# Altium schematic sheet Power_Sheet.SchDoc
size A3
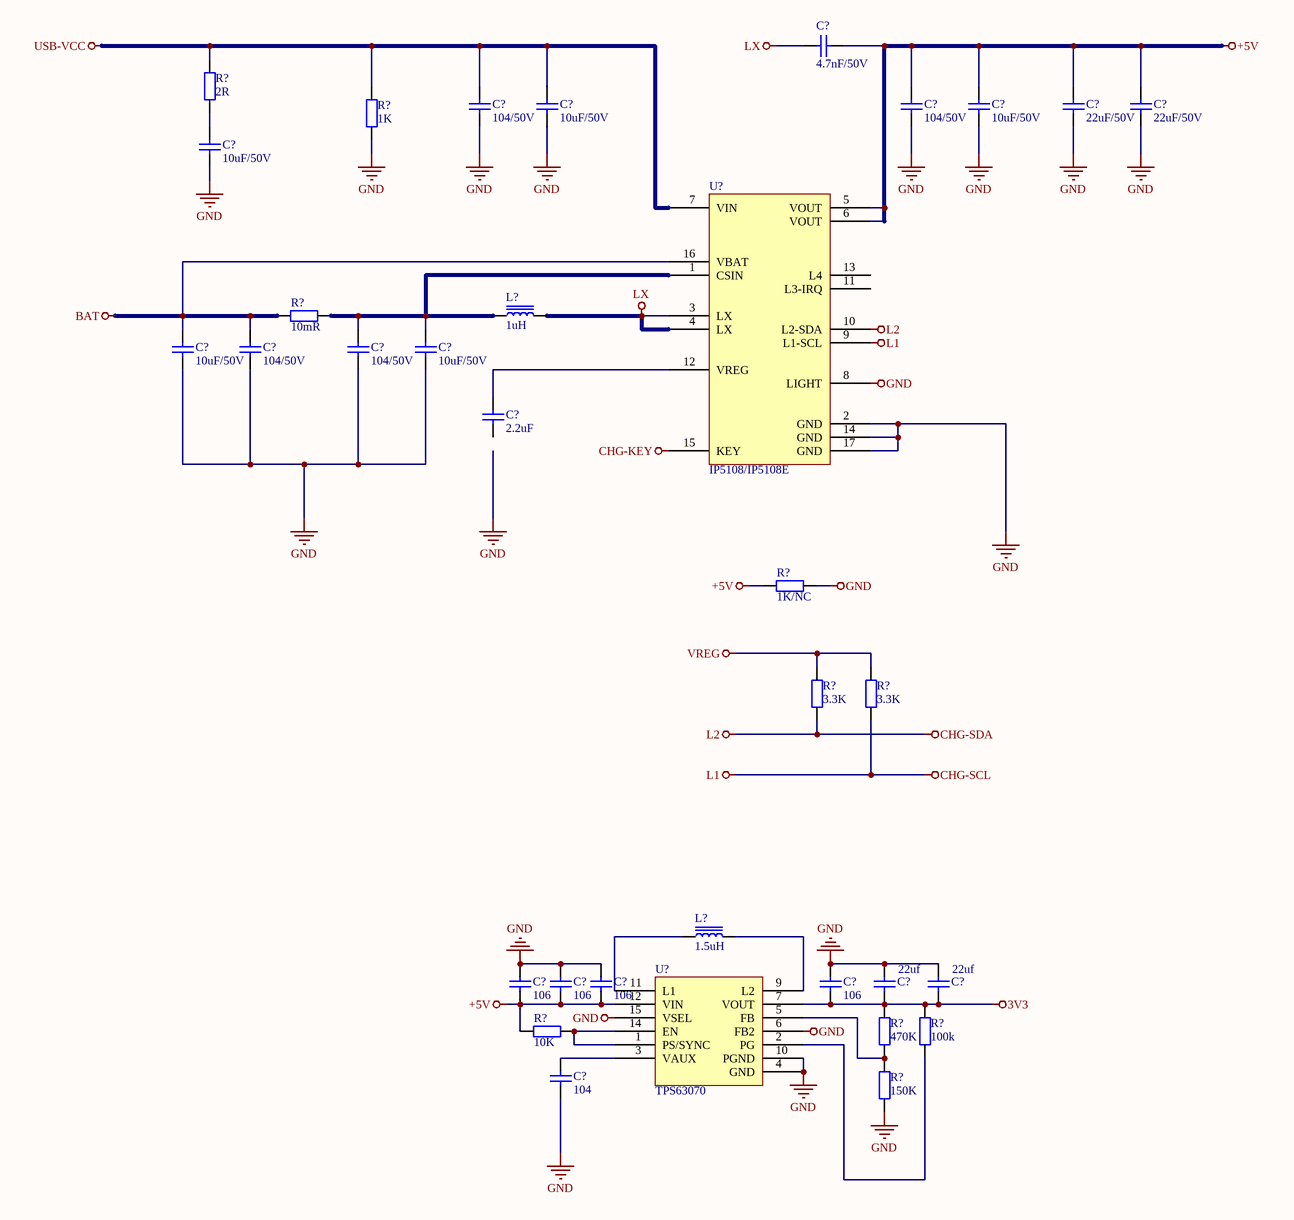
[diagram p0: Power_Sheet.SchDoc]

## Parts
(Parts that share a designator on the sheet are numbered #1, #2 ... from top to bottom, then left to right.)
C?#1  _Parameter: 4.7nF/50V  [电容_C0603]  (hidden comment: 4.7nF)
C?#2  _Parameter: 104/50V  [电容_C0603]  (hidden comment: 104)
C?#3  _Parameter: 10uF/50V  [电容_C0603]  (hidden comment: 10uF)
C?#4  _Parameter: 104/50V  [电容_C0603]  (hidden comment: 104)
C?#5  _Parameter: 10uF/50V  [电容_C0603]  (hidden comment: 10uF)
C?#6  _Parameter: 22uF/50V  [电容_C1206]  (hidden comment: 22uF)
C?#7  _Parameter: 22uF/50V  [电容_C1206]  (hidden comment: 22uF)
C?#8  _Parameter: 10uF/50V  [电容_C0603]  (hidden comment: 10uF)
C?#9  _Parameter: 10uF/50V  [电容_C0603]  (hidden comment: 10uF)
C?#10  _Parameter: 104/50V  [电容_C0603]  (hidden comment: 104)
C?#11  _Parameter: 104/50V  [电容_C0603]  (hidden comment: 104)
C?#12  _Parameter: 10uF/50V  [电容_C0603]  (hidden comment: 10uF)
C?#13  _Parameter: 2.2uF  [电容_C0603]  (hidden comment: 104)
C?#14  106  [电容_C0805]
C?#15  106  [电容_C0805]
C?#16  106  [电容_C0603]
C?#17  106  [电容_C0603]
C?#18  22uf  [电容_C1206]
C?#19  22uf  [电容_C1206]
C?#20  104  [电容_C0603]
L?#1  1uH  [变压器电感_CD54]
L?#2  1.5uH  [变压器电感_0420]
R?#1  2R  [电阻_R0603]
R?#2  1K  [电阻_R0603]
R?#3  10mR  [电阻_R2512]
R?#4  1K/NC  [电阻_R0603]
R?#5  3.3K  [电阻_R0603]
R?#6  3.3K  [电阻_R0603]
R?#7  10K  [电阻_R0603]
R?#8  470K  [电阻_R0603]
R?#9  100k  [电阻_R0603]
R?#10  150K  [电阻_R0603]
U?#1  IP5108/IP5108E  [SOP16_PWR]
U?#2  TPS63070  [VQFN-15-HR]

## Nets
3V3: C?#17.1 C?#18.1 C?#19.1 R?#8.1 R?#9.1 U?#2.7(VOUT)
+5V: C?#1.1 C?#4.2 C?#5.2 C?#6.2 C?#7.2 C?#14.1 C?#15.1 C?#16.1 R?#4.1 R?#7.2 U?#1.5(VOUT) U?#1.6(VOUT) U?#2.12(VIN)
BAT: C?#9.2 C?#10.2 R?#3.1 U?#1.16(VBAT)
CHG-KEY: U?#1.15(KEY)
CHG-SCL: R?#6.1 U?#1.9(L1-SCL)  [also labelled L1]
CHG-SDA: R?#5.1 U?#1.10(L2-SDA)  [also labelled L2]
GND: C?#2.1 C?#3.1 C?#4.1 C?#5.1 C?#6.1 C?#7.1 C?#8.1 C?#9.1 C?#10.1 C?#11.1 C?#12.1 C?#14.2 C?#15.2 C?#16.2 C?#17.2 C?#18.2 C?#19.2 C?#20.1 R?#2.2 R?#4.2 R?#10.2 U?#1.2(GND) U?#1.8(LIGHT) U?#1.14(GND) U?#1.17(GND) U?#2.4(GND) U?#2.6(FB2) U?#2.10(PGND) U?#2.15(VSEL)
LX: C?#1.2 L?#1.2 U?#1.3(LX) U?#1.4(LX)
USB-VCC: C?#2.2 C?#3.2 R?#1.1 R?#2.1 U?#1.7(VIN)
VREG: R?#5.2 R?#6.2
NetC?#8_2: C?#8.2 R?#1.2
NetC?#11_2: C?#11.2 C?#12.2 L?#1.1 R?#3.2 U?#1.1(CSIN)
NetC?#13_2: C?#13.2 U?#1.12(VREG)
NetC?#20_2: C?#20.2 U?#2.3(VAUX)
NetL?#2_1: L?#2.1 U?#2.11(L1)
NetL?#2_2: L?#2.2 U?#2.9(L2)
NetR?#7_1: R?#7.1 U?#2.1(PS/SYNC) U?#2.14(EN)
NetR?#8_2: R?#8.2 R?#10.1 U?#2.5(FB)
NetR?#9_2: R?#9.2 U?#2.2(PG)

Not connected (* = marked no-connect by the designer): C?#13 1; U?#1 11(L3-IRQ) 13(L4)

## Library data of the parts
C?#1 = Cap: _Material: X7R; _Voltage: 50V; _Slash: /; _Specification: Cap,0805,X7R,4.7nF,50V,10%; _Comma: ,; _Accuracy: 10%; _Footprint: 0805; _Capacitance: 4.7nF; _Name: Cap
C?#2 C?#4 C?#10 C?#11 C?#13 = Cap: _Material: X7R; _Voltage: 50V; _Slash: /; _Specification: Cap,0805,X7R,104,50V,10%; _Comma: ,; _Accuracy: 10%; _Footprint: 0805; _Capacitance: 104; _Name: Cap
C?#3 C?#5 C?#8 C?#9 C?#12 = Cap: _Material: X7R; _Voltage: 50V; _Slash: /; _Specification: Cap,0805,X7R,10uF,50V,10%; _Comma: ,; _Accuracy: 10%; _Footprint: 0805; _Capacitance: 10uF; _Name: Cap
C?#6 C?#7 = Cap: _Material: X7R; _Voltage: 50V; _Slash: /; _Specification: Cap,0805,X7R,22uF,50V,10%; _Comma: ,; _Accuracy: 10%; _Footprint: 0805; _Capacitance: 22uF; _Name: Cap
C?#14-C?#20 = cap: U: 50V; 参数: Cap,0805,X7R,104K,50V,125C,±10%
  C?#14-C?#17: C: 106
  C?#18 C?#19: C: 22uf
  C?#20: C: 104
L?#1 = Inductor Iron 2: _Current: 10A; _Accuracy: 20%; _Footprint: 1040; _Name: IND; _Specification: IND,1040,1uH,10A,20%; _Comma: ,; _Value: 1uH
L?#2 = Inductor Iron 2: _Current: 10A; _Accuracy: 20%; _Footprint: 1040; _Name: IND; _Specification: IND,1040,1.5uH,10A,20%; _Comma: ,; _Value: 1.5uH
R?#1 = Res: _Accuracy: 1%; _Power: 1/8W; _Footprint: 0805; _Drift: 100ppm; _Comma: ,; _Specification: Res,0805,2R,1%,1/8W,100ppm; _Name: Res; _Value: 2R
R?#2 = Res: _Accuracy: 1%; _Power: 1/8W; _Footprint: 0805; _Drift: 100ppm; _Comma: ,; _Specification: Res,0805,1K,1%,1/8W,100ppm; _Name: Res; _Value: 1K
R?#3 = Res: _Accuracy: 1%; _Power: 1/8W; _Footprint: 0805; _Drift: 100ppm; _Comma: ,; _Specification: Res,0805,10mR,1%,1/8W,100ppm; _Name: Res; _Value: 10mR
R?#4 = Res: _Accuracy: 1%; _Power: 1/8W; _Footprint: 0805; _Drift: 100ppm; _Comma: ,; _Specification: Res,0805,1K/NC,1%,1/8W,100ppm; _Name: Res; _Value: 1K/NC
R?#5 R?#6 = Res: _Accuracy: 1%; _Power: 1/8W; _Footprint: 0805; _Drift: 100ppm; _Comma: ,; _Specification: Res,0805,3.3K,1%,1/8W,100ppm; _Name: Res; _Value: 3.3K
R?#7-R?#10 = Res: P: 1/8W; 参数: Res,0805,0R,±1%,1/8W,100ppm,155C
  R?#7: R: 10K
  R?#8: R: 470K
  R?#9: R: 100k
  R?#10: R: 150K
U?#1 = IP5108/IP5108E: 2A/1A Charger SoC
U?#2 = TPS63070: 降压-升压转换器